# EAGLE schematic merged (EAGLE 9.6.2)

## Sheet 1 of 4
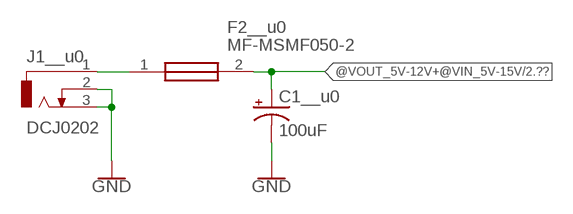
[diagram p0: schematic, sheet 1]

### Parts
C1__u0  100uF  100UF-POLAR-EIA7343-10V-10%(TANT)  [EIA7343]
F2__u0  MF-MSMF050-2  [FUSC4632X85N]
J1__u0  DCJ0202  [DCJ0202]

### Nets
@VOUT_5V-12V+@VIN_5V-15V: C1__u0.A(+) F2__u0.2 ; also sheet 2
GND: C1__u0.C(-) J1__u0.2 J1__u0.3 ; also sheet 2,3,4
N$1__u0: F2__u0.1 J1__u0.1

## Sheet 2 of 4
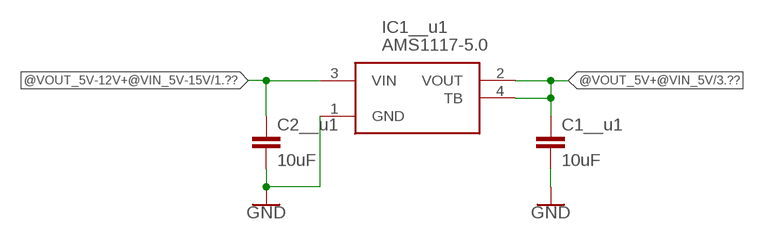
[diagram p1: schematic, sheet 2]

### Parts
C1__u1  10uF  10UF-0603-6.3V-20%  [0603]
C2__u1  10uF  10UF-0603-6.3V-20%  [0603]
IC1__u1  AMS1117-5.0  [SOT290P700X180-4N]

### Nets
@VOUT_5V+@VIN_5V: C1__u1.1 IC1__u1.2(VOUT) IC1__u1.4(TB) ; also sheet 3
@VOUT_5V-12V+@VIN_5V-15V: C2__u1.1 IC1__u1.3(VIN) ; also sheet 1
GND: C1__u1.2 C2__u1.2 IC1__u1.1(GND) ; also sheet 1,3,4

## Sheet 3 of 4
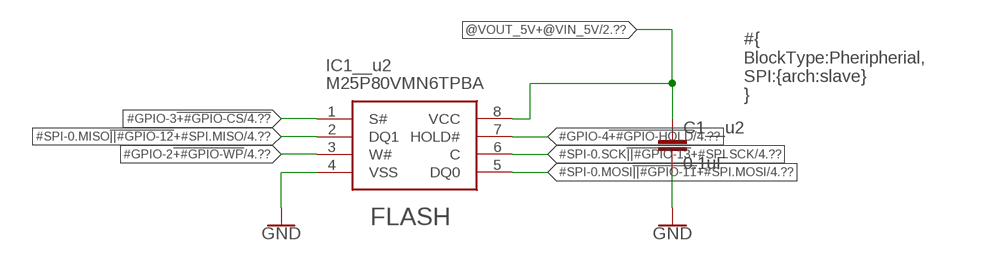
[diagram p2: schematic, sheet 3]

### Parts
C1__u2  0.1uF  0.1UF-0603-25V-(+80/-20%)  [0603]
IC1__u2  M25P80VMN6TPBA  [SOIC127P600X175-8N]

### Nets
#GPIO-2!+#GPIO-WP!: IC1__u2.3(W#) ; also sheet 4
#GPIO-3!+#GPIO-CS: IC1__u2.1(S#) ; also sheet 4
#GPIO-4!+#GPIO-HOLD!: IC1__u2.7(HOLD#) ; also sheet 4
#SPI-0.MISO!||#GPIO-12!+#SPI.MISO: IC1__u2.2(DQ1) ; also sheet 4
#SPI-0.MOSI!||#GPIO-11!+#SPI.MOSI: IC1__u2.5(DQ0) ; also sheet 4
#SPI-0.SCK!||#GPIO-13!+#SPI.SCK: IC1__u2.6(C) ; also sheet 4
@VOUT_5V+@VIN_5V: C1__u2.1 IC1__u2.8(VCC) ; also sheet 2
GND: C1__u2.2 IC1__u2.4(VSS) ; also sheet 1,2,4

### Notes on the sheet
- #{
  BlockType:Pheripherial,
  SPI:{arch:slave}
  }
- FLASH

## Sheet 4 of 4
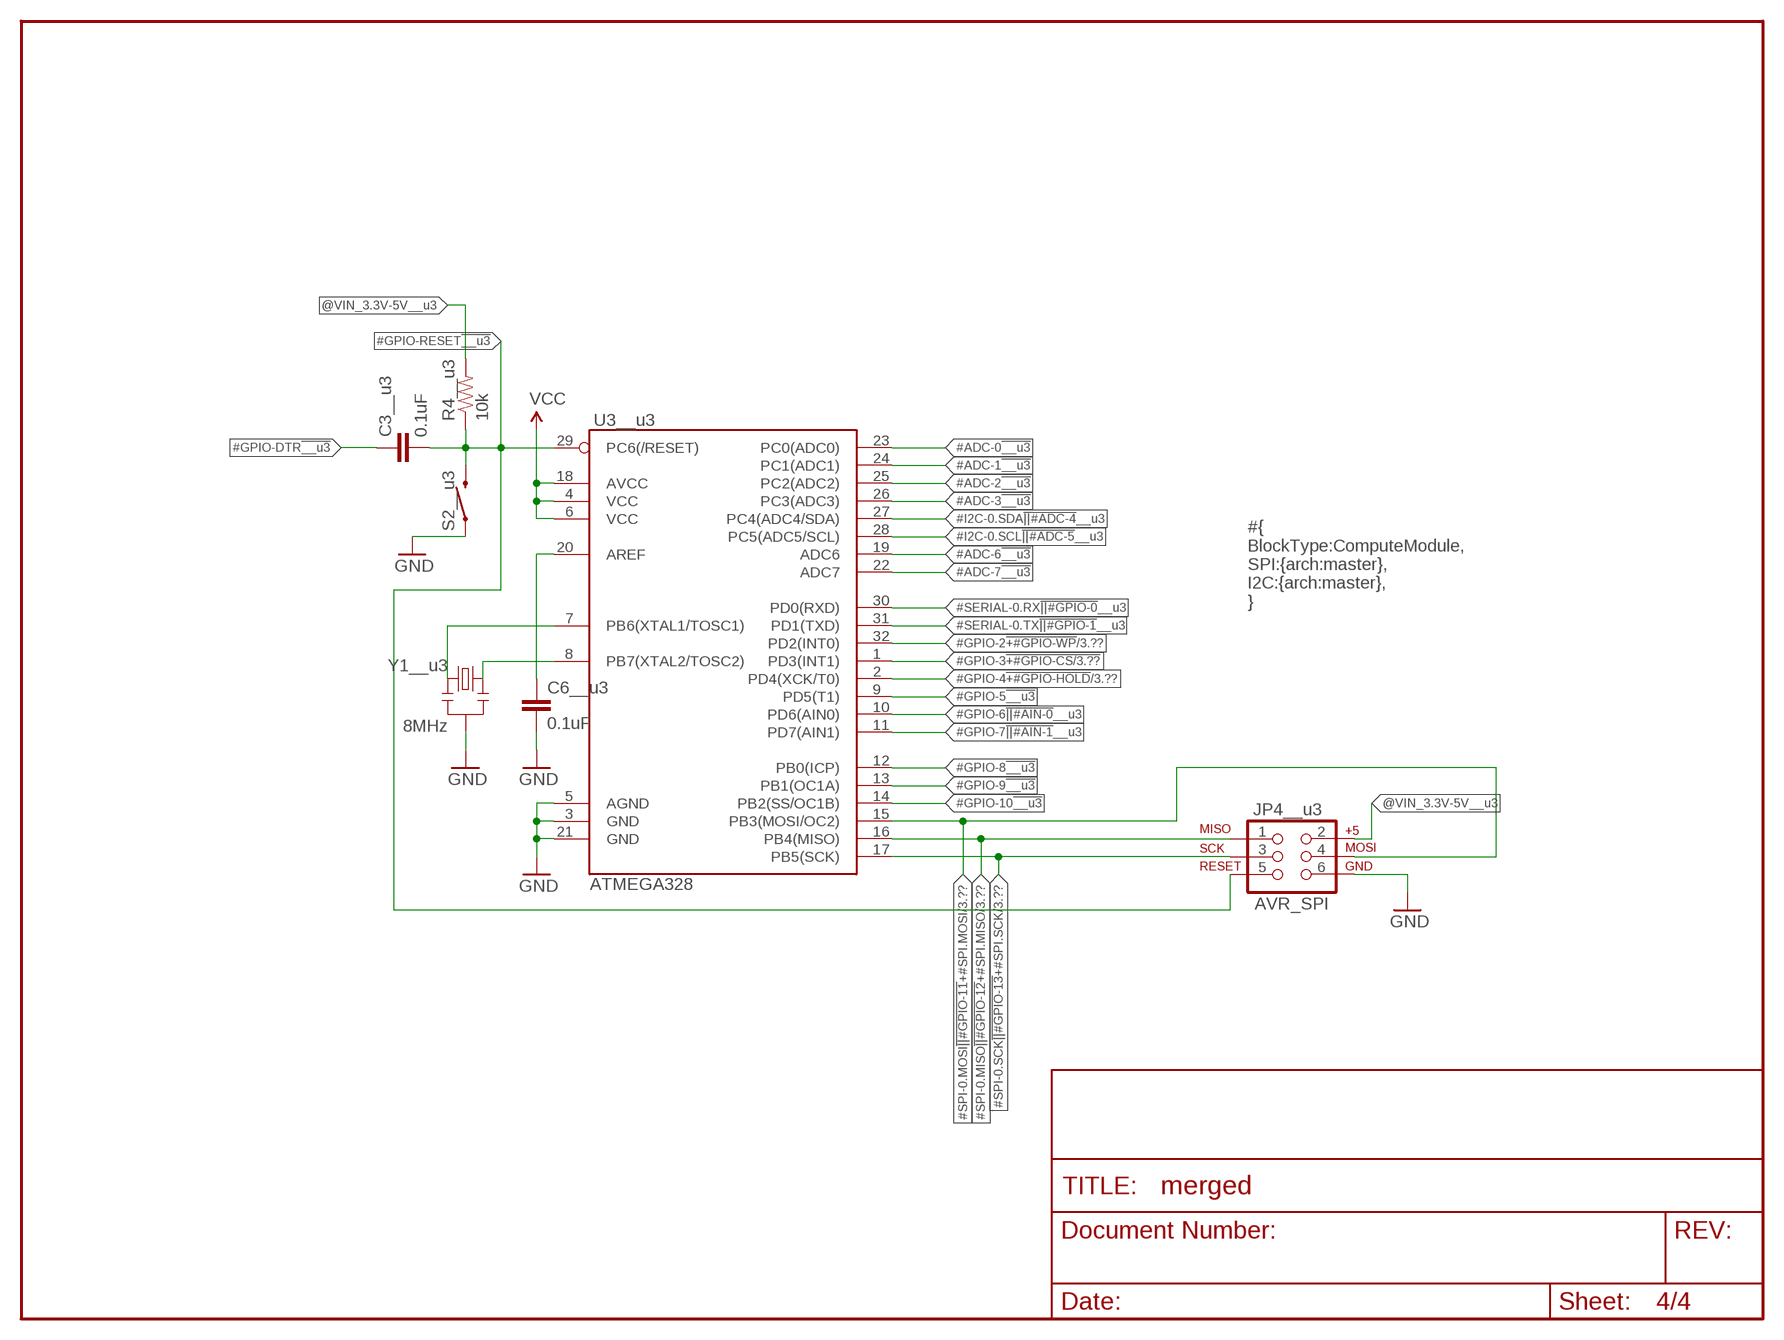
[diagram p3: schematic, sheet 4]

### Parts
C3__u3  0.1uF  0.1UF-0603-25V-5%  [0603]
C6__u3  0.1uF  0.1UF-0603-25V-5%  [0603]
JP4__u3  AVR_SPI  AVR_SPI_PRG_6PTH  [2X3]
R4__u3  10k  10KOHM-0603-1/10W-1%  [0603]
S2__u3  MOMENTARY-SWITCH-SPST-SMD-6.2MM-TALL  [TACTILE_SWITCH_SMD_6.2MM_TALL]
U3__u3  ATMEGA328  ATMEGA168  [TQFP32-08]
Y1__u3  8MHz  RESONATORSMD  [RESONATOR-SMD]

### Nets
#ADC-0!__u3: U3__u3.23(PC0(ADC0))
#ADC-1!__u3: U3__u3.24(PC1(ADC1))
#ADC-2!__u3: U3__u3.25(PC2(ADC2))
#ADC-3!__u3: U3__u3.26(PC3(ADC3))
#ADC-6!__u3: U3__u3.19(ADC6)
#ADC-7!__u3: U3__u3.22(ADC7)
#GPIO-2!+#GPIO-WP!: U3__u3.32(PD2(INT0)) ; also sheet 3
#GPIO-3!+#GPIO-CS: U3__u3.1(PD3(INT1)) ; also sheet 3
#GPIO-4!+#GPIO-HOLD!: U3__u3.2(PD4(XCK/T0)) ; also sheet 3
#GPIO-5!__u3: U3__u3.9(PD5(T1))
#GPIO-6!||#AIN-0!__u3: U3__u3.10(PD6(AIN0))
#GPIO-7!||#AIN-1!__u3: U3__u3.11(PD7(AIN1))
#GPIO-8!__u3: U3__u3.12(PB0(ICP))
#GPIO-9!__u3: U3__u3.13(PB1(OC1A))
#GPIO-10!__u3: U3__u3.14(PB2(SS/OC1B))
#GPIO-DTR!__u3: C3__u3.1
#GPIO-RESET!__u3: C3__u3.2 JP4__u3.5 R4__u3.1 S2__u3.B2 U3__u3.29(PC6(/RESET))
#I2C-0.SCL!||#ADC-5!__u3: U3__u3.28(PC5(ADC5/SCL))
#I2C-0.SDA!||#ADC-4!__u3: U3__u3.27(PC4(ADC4/SDA))
#SERIAL-0.RX!||#GPIO-0!__u3: U3__u3.30(PD0(RXD))
#SERIAL-0.TX!||#GPIO-1!__u3: U3__u3.31(PD1(TXD))
#SPI-0.MISO!||#GPIO-12!+#SPI.MISO: JP4__u3.1 U3__u3.16(PB4(MISO)) ; also sheet 3
#SPI-0.MOSI!||#GPIO-11!+#SPI.MOSI: JP4__u3.4 U3__u3.15(PB3(MOSI/OC2)) ; also sheet 3
#SPI-0.SCK!||#GPIO-13!+#SPI.SCK: JP4__u3.3 U3__u3.17(PB5(SCK)) ; also sheet 3
@VIN_3.3V-5V__u3: JP4__u3.2 R4__u3.2
AREF__u3: C6__u3.1 U3__u3.20(AREF)
GND: C6__u3.2 JP4__u3.6 S2__u3.A2 U3__u3.3(GND) U3__u3.5(AGND) U3__u3.21(GND) Y1__u3.2 ; also sheet 1,2,3
N$10__u3: U3__u3.7(PB6(XTAL1/TOSC1)) Y1__u3.3
N$12__u3: U3__u3.8(PB7(XTAL2/TOSC2)) Y1__u3.1
VCC__u3: U3__u3.4(VCC) U3__u3.6(VCC) U3__u3.18(AVCC) ; supply symbol labelled VCC

### Notes on the sheet
- #{
  BlockType:ComputeModule,
  SPI:{arch:master},
  I2C:{arch:master},
  }

## Library data of the parts
C1__u0 = SparkFun-Capacitors__u0:100UF-POLAR: 100µF polarized capacitors A capacitor is a passive two-terminal electrical component used to store electrical energy temporarily in an electric field.; PROD_ID: CAP-07890
C1__u1 C2__u1 = SparkFun-Capacitors__u1:10UF: 10.0µF ceramic capacitors A capacitor is a passive two-terminal electrical component used to store electrical energy temporarily in an electric field.; PROD_ID: CAP-11015
C1__u2 = SparkFun-Capacitors__u2:0.1UF: 0.1µF ceramic capacitors A capacitor is a passive two-terminal electrical component used to store electrical energy temporarily in an electric field.; PROD_ID: CAP-00810
C3__u3 C6__u3 = SparkFun-Capacitors__u3:0.1UF: 0.1µF ceramic capacitors A capacitor is a passive two-terminal electrical component used to store electrical energy temporarily in an electric field.; PROD_ID: CAP-08604
F2__u0 = MF-MSMF050-2__u0:MF-MSMF050-2: Fuse, PTC, Resettable, SMD, 1812, 500mA Bourns 0.5A Surface Mount Resettable Fuse, 15 V Source: Datasheet <https://www.bourns.com/pdfs/mfmsmf.pdf>; ARROW_PART_NUMBER: MF-MSMF050-2; ARROW_PRICE-STOCK: https://www.arrow.com/en/products/mf-msmf050-2/bourns?region=nac; DESCRIPTION: Fuse, PTC, Resettable, SMD, 1812, 500mA Bourns 0.5A Surface Mount Resettable Fuse, 15 V; HEIGHT: 0.85mm; MANUFACTURER_NAME: Bourns; MANUFACTURER_PART_NUMBER: MF-MSMF050-2; MOUSER_PART_NUMBER: 652-MF-MSMF050-2; MOUSER_PRICE-STOCK: https://www.mouser.co.uk/ProductDetail/Bourns/MF-MSMF050-2?qs=t3shhpq1i1DZ7OBD5kLNoA%3D%3D
IC1__u1 = AMS1117-5.0__u1:AMS1117-5.0: Low Dropout Regulators(LDO) SOT-223 RoHS Source: Datasheet <https://datasheet.lcsc.com/szlcsc/SK-AMS1117-5-0_C165483.pdf>; DESCRIPTION: Low Dropout Regulators(LDO) SOT-223 RoHS; HEIGHT: 1.8mm; MANUFACTURER_NAME: Shikues; MANUFACTURER_PART_NUMBER: AMS1117-5.0
IC1__u2 = M25P80VMN6TPBA__u2:M25P80VMN6TPBA: Micron M25P80 Serial Flash Embedded Memory Source: Datasheet <https://www.digchip.com/datasheets/parts/datasheet/3454/M25P80VMN6TPBA-pdf.php>; DESCRIPTION: Micron M25P80 Serial Flash Embedded Memory; HEIGHT: 1.75mm; MANUFACTURER_NAME: Micron; MANUFACTURER_PART_NUMBER: M25P80VMN6TPBA
J1__u0 = con-jack__u0:DCJ0202: DC POWER JACK Source: DCJ0202.pdf; OC_FARNELL: unknown; OC_NEWARK: unknown
JP4__u3 = SparkFun__u3:AVR_SPI_PRG_6: AVR ISP 6 Pin This is the reduced ISP connector for AVR programming. Common on Arduino. This footprint will take up less PCB space and can be used with a 10-pin to 6-pin adapter such as SKU: BOB-08508
R4__u3 = SparkFun-Resistors__u3:10KOHM: 10kΩ resistor A resistor is a passive two-terminal electrical component that implements electrical resistance as a circuit element. Resistors act to reduce current flow, and, at the same time, act to lower voltage levels within circuits. - Wikipedia; PROD_ID: RES-00824
S2__u3 = SparkFun-Switches__u3:MOMENTARY-SWITCH-SPST: Momentary Switch (Pushbutton) - SPST Normally-open (NO) SPST momentary switches (buttons, pushbuttons). Variants PTH-12MM - 12mm square, through-hole Momentary Pushbutton Switch - 12mm Square <https://www.sparkfun.com/products/9190> (COM-09190) PTH-6.0MM, PTH-6.0MM-KIT - 6.0mm square, through-hole Mini Pushbutton Switch <https://www.sparkfun.com/products/97> (COM-00097) KIT package intended for soldering kit's - only one side of pads' copper is exposed. PTH-RIGHT-ANGLE-KIT - Right-angle, through-hole Right Angle Tactile Button <https://www.sparkfun.com/products/10791> - Used on SparkFun BigTime Watch Kit <https://www.sparkfun.com/products/11734> SMD-12MM - 12mm square, surface-mount Tactile Button - SMD (12mm) <https://www.sparkfun.com/products/12993> (COM-12993) Used on SparkFun PicoBoard <https://www.sparkfun.com/products/11888> SMD-4.5MM - 4.5mm Square Trackball Switch Used on SparkFun Blackberry Trackballer Breakout <https://www.sparkfun.com/products/13169> SMD-4.6MMX2.8MM - 4.60mm x 2.80mm, surface mount Used on SparkFun SAMD21 Mini Breakout <https://www.sparkfun.com/products/13664> SMD-5.2MM, SMD-5.2-REDUNDANT - 5.2mm square, surface-mount Mini Pushbutton Switch - SMD <https://www.sparkfun.com/products/8720> (COM-08720) Used on Arduino Pro Mini <https://www.sparkfun.com/products/11114> REDUNDANT package connects both switch circuits together SMD-6.0X3.5MM - 6.0 x 3.5mm, surface mount Momentary Reset Switch SMD <https://www.sparkfun.com/products/8229> (COM-08229) SMD-6.2MM-TALL - 6.2mm square, surface mount Tactile Button - SMD (6mm) <https://www.sparkfun.com/products/12992> Used on SparkFun Digital Sandbox <https://www.sparkfun.com/products/12651> SMD-RIGHT-ANGLE - Right-angle, surface mount Used on SparkFun Block for Intel® Edison - Arduino <https://www.sparkfun.com/products/13036>; PROD_ID: SWCH-11966; SF_SKU: COM-12992
U3__u3 = SparkFun__u3:ATMEGA168
Y1__u3 = SparkFun__u3:RESONATOR: Resonator Small SMD resonator. This is the itty bitty 10/20MHz resonators with built in caps. CSTCE10M0G55 and CSTCE20M0V53. Footprint has been reviewed closely but hasn't been tested yet.